# Altium schematic sheet Controller.SchDoc
size A; SheetNumber: 1; SheetTotal: 4
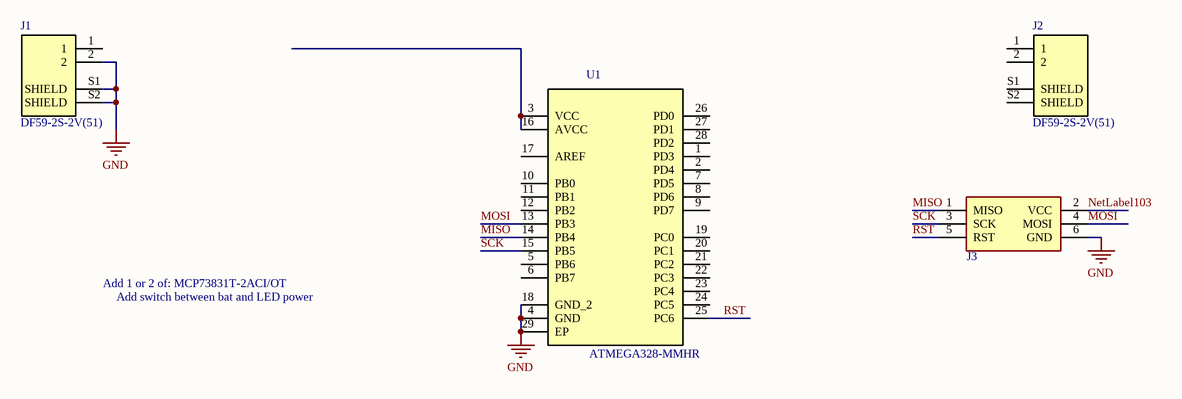
[diagram p0: Controller.SchDoc]

## Parts
J1  DF59-2S-2V(51)  [SNAPBEE_DF59-2S-2V]
J2  DF59-2S-2V(51)  [SNAPBEE_DF59-2S-2V]
J3  6 Pin ISP Header  [CONN_ISP_M]  (value not drawn)
U1  ATMEGA328-MMHR  [QFN-28_4x4]

## Nets
GND: J1.2 J1.S1(SHIELD) J1.S2(SHIELD) J3.6(GND) U1.4(GND) U1.18(GND_2) U1.29(EP)
MISO: J3.1(MISO) U1.14(PB4)
MOSI: J3.4(MOSI) U1.13(PB3)
NetLabel103: J3.2(VCC)
RST: J3.5(RST) U1.25(PC6)
SCK: J3.3(SCK) U1.15(PB5)
NetU1_3: U1.3(VCC) U1.16(AVCC)

Not connected (* = marked no-connect by the designer): J1 1; J2 1 2 S1(SHIELD) S2(SHIELD); U1 1(PD3) 2(PD4) 5(PB6) 6(PB7) 7(PD5) 8(PD6) 9(PD7) 10(PB0) 11(PB1) 12(PB2) 17(AREF) 19(PC0) 20(PC1) 21(PC2) 22(PC3) 23(PC4) 24(PC5) 26(PD0) 27(PD1) 28(PD2)

## Notes on the sheet
- Add 1 or 2 of: MCP73831T-2ACI/OT
- Add switch between bat and LED power

## Library data of the parts
J1 J2 = SNAPBEE_DF59-2S-2V: CONN SSL RCPT 2POS 2MM SOLDER; Supplier 1: Digi-Key; Supplier 2: Digi-Key; Supplier 3: Digi-Key; Supplier Part Number 1: H11961CT-ND; Supplier Part Number 2: H11958-ND; Supplier Part Number 3: H11957CT-ND
J3 = ISP
U1 = ATMEGA328-MMHR: IC MCU 8BIT 32KB FLASH 28VQFN; MF: Microchip; MP: ATMEGA328P-PU; SnapEDA_Link: https://www.snapeda.com/parts/ATMEGA328P-PU/Microchip/view-part/?ref=snap; Package: PDIP-28 Microchip; Price: None; Availability: Unavailable; Value: *; Supplier 1: Digi-Key; Supplier Part Number 1: ATMEGA328-MMHRCT-ND